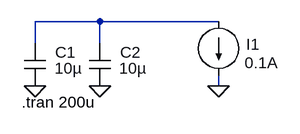
[diagram p0: schematic setup_ch0_input-capacitor-energy.asc]
setup_ch0_input-capacitor-energy.asc, the LTspice schematic file:
Version 4
SHEET 1 3288 1156
WIRE 1232 512 1136 512
WIRE 1408 512 1232 512
WIRE 1136 544 1136 512
WIRE 1232 544 1232 512
WIRE 1408 608 1408 592
FLAG 1136 608 0
FLAG 1232 608 0
FLAG 1408 608 0
SYMBOL cap 1120 544 R0
WINDOW 0 46 14 Left 2
WINDOW 3 45 38 Left 2
SYMATTR InstName C1
SYMATTR Value 10µ
SYMATTR SpiceLine Rser=10m
SYMATTR SpiceLine2 ic=4
SYMBOL cap 1216 544 R0
WINDOW 0 46 14 Left 2
WINDOW 3 45 38 Left 2
SYMATTR InstName C2
SYMATTR Value 10µ
SYMATTR SpiceLine Rser=10m
SYMATTR SpiceLine2 ic=4
SYMBOL current 1408 512 R0
WINDOW 0 41 34 Left 2
WINDOW 3 39 62 Left 2
WINDOW 123 0 0 Left 2
WINDOW 39 0 0 Left 2
SYMATTR InstName I1
SYMATTR Value 0.1A
TEXT 1116 632 Left 2 !.tran 200u

The netlist it stands for:
* setup_ch0_input-capacitor-energy.asc
C1 N001 0 10µ Rser=10m ic=4
C2 N001 0 10µ Rser=10m ic=4
I1 N001 0 0.1A
.tran 200u
.backanno
.end